# Altium project YOUTUBE_COUNTER_V01R01.PrjPCB (part 2 of 2)

## Sheet [05] - DISP DRIVERS.SchDoc: DISPLAY DRIVERS
size 433 x 279 mm; Author: ZAG; DrawnBy: ZAG; DocumentNumber: 6; SheetNumber: 5; SheetTotal: 7; PageSetup: Record=PageOptions|CenterHorizontal=True|CenterVertical=True|PrintScale=0.96|XCorrection=1.00|YCorrection=1.00|PrintKind=2|BorderSize=5000000|LeftOffset=0|BottomOffset=0|Orientation=2|PaperLength=4318|PaperWidth=2794|Scale=100|PaperSource=15|PrintQuality=600|MediaType=1|DitherType=10|PaperKind=11x17|PrintScaleMode=1; ClientCompanyName: Mule Labs, LLC; ClientContactEmail: zack@mule-labs.com; PCBRevision: 01; SchRevision: 01; Project: YOUTUBE SUBSCRIBER COUNTER; SchStatus: PRELIMINARY
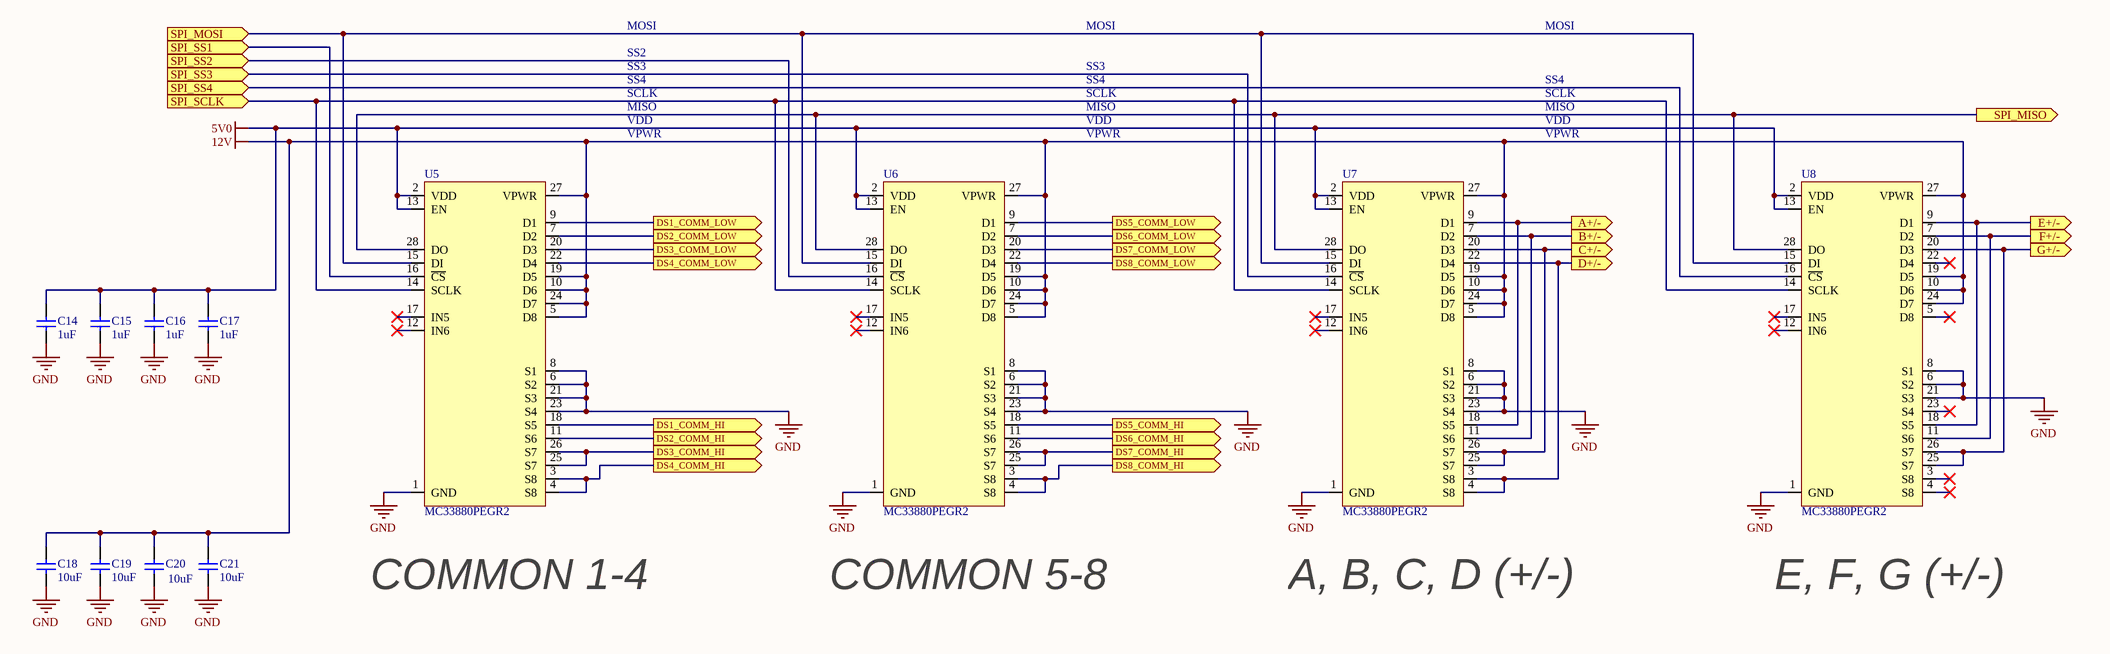
[diagram p3: [05] - DISP DRIVERS.SchDoc]

### Parts
C14  1uF  [INCH 0603 - METRIC 1608 - H090]
C15  1uF  [INCH 0603 - METRIC 1608 - H090]
C16  1uF  [INCH 0603 - METRIC 1608 - H090]
C17  1uF  [INCH 0603 - METRIC 1608 - H090]
C18  10uF  [INCH 0805 - METRIC 2012 - H140]
C19  10uF  [INCH 0805 - METRIC 2012 - H140]
C20  10uF  [INCH 0805 - METRIC 2012 - H140]
C21  10uF  [INCH 0805 - METRIC 2012 - H140]
U5  MC33880PEGR2  [SOIC28P127_1792X1030X265L65X42]
U6  MC33880PEGR2  [SOIC28P127_1792X1030X265L65X42]
U7  MC33880PEGR2  [SOIC28P127_1792X1030X265L65X42]
U8  MC33880PEGR2  [SOIC28P127_1792X1030X265L65X42]

### Ports
A+/- (out), B+/- (out), C+/- (out), D+/- (out), DS1_COMM_HI (out), DS1_COMM_LOW (out), DS2_COMM_HI (out), DS2_COMM_LOW (out), DS3_COMM_HI (out), DS3_COMM_LOW (out), DS4_COMM_HI (out), DS4_COMM_LOW (out), DS5_COMM_HI (out), DS5_COMM_LOW (out), DS6_COMM_HI (out), DS6_COMM_LOW (out), DS7_COMM_HI (out), DS7_COMM_LOW (out), DS8_COMM_HI (out), DS8_COMM_LOW (out), E+/- (out), F+/- (out), G+/- (out), SPI_MISO (out), SPI_MOSI (in), SPI_SCLK (in), SPI_SS1 (in), SPI_SS2 (in), SPI_SS3 (in), SPI_SS4 (in)

### Nets
5V0: C14.1 C15.1 C16.1 C17.1 U5.2(VDD) U5.13(EN) U6.2(VDD) U6.13(EN) U7.2(VDD) U7.13(EN) U8.2(VDD) U8.13(EN)
12V: C18.1 C19.1 C20.1 C21.1 U5.5(D8) U5.10(D6) U5.19(D5) U5.24(D7) U5.27(VPWR) U6.5(D8) U6.10(D6) U6.19(D5) U6.24(D7) U6.27(VPWR) U7.5(D8) U7.10(D6) U7.19(D5) U7.24(D7) U7.27(VPWR) U8.10(D6) U8.19(D5) U8.24(D7) U8.27(VPWR)
GND: C14.2 C15.2 C16.2 C17.2 C18.2 C19.2 C20.2 C21.2 U5.1(GND) U5.6(S2) U5.8(S1) U5.21(S3) U5.23(S4) U6.1(GND) U6.6(S2) U6.8(S1) U6.21(S3) U6.23(S4) U7.1(GND) U7.6(S2) U7.8(S1) U7.21(S3) U7.23(S4) U8.1(GND) U8.6(S2) U8.8(S1) U8.21(S3)
NetD4_1: U5.18(S5) ; port DS1_COMM_HI
NetD4_2: U5.9(D1) ; port DS1_COMM_LOW
NetD11_1: U5.11(S6) ; port DS2_COMM_HI
NetD11_2: U5.7(D2) ; port DS2_COMM_LOW
NetD18_1: U5.25(S7) U5.26(S7) ; port DS3_COMM_HI
NetD18_2: U5.20(D3) ; port DS3_COMM_LOW
NetD25_1: U5.3(S8) U5.4(S8) ; port DS4_COMM_HI
NetD25_2: U5.22(D4) ; port DS4_COMM_LOW
NetD32_1: U6.18(S5) ; port DS5_COMM_HI
NetD32_2: U6.9(D1) ; port DS5_COMM_LOW
NetD39_1: U6.11(S6) ; port DS6_COMM_HI
NetD39_2: U6.7(D2) ; port DS6_COMM_LOW
NetU3_26: U8.16(~{CS}) ; port SPI_SS4
NetU3_27: U7.16(~{CS}) ; port SPI_SS3
NetU3_28: U6.16(~{CS}) ; port SPI_SS2
NetU3_29: U5.16(~{CS}) ; port SPI_SS1
NetU3_30: U5.14(SCLK) U6.14(SCLK) U7.14(SCLK) U8.14(SCLK) ; port SPI_SCLK
NetU3_31: U5.28(DO) U6.28(DO) U7.28(DO) U8.28(DO) ; port SPI_MISO
NetU3_32: U5.15(DI) U6.15(DI) U7.15(DI) U8.15(DI) ; port SPI_MOSI
NetU6_3: U6.3(S8) U6.4(S8) ; port DS8_COMM_HI
NetU6_20: U6.20(D3) ; port DS7_COMM_LOW
NetU6_22: U6.22(D4) ; port DS8_COMM_LOW
NetU6_25: U6.25(S7) U6.26(S7) ; port DS7_COMM_HI
NetU7_3: U7.3(S8) U7.4(S8) U7.22(D4) ; port D+/-
NetU7_7: U7.7(D2) U7.11(S6) ; port B+/-
NetU7_9: U7.9(D1) U7.18(S5) ; port A+/-
NetU7_20: U7.20(D3) U7.25(S7) U7.26(S7) ; port C+/-
NetU8_7: U8.7(D2) U8.11(S6) ; port F+/-
NetU8_9: U8.9(D1) U8.18(S5) ; port E+/-
NetU8_20: U8.20(D3) U8.25(S7) U8.26(S7) ; port G+/-

Not connected (* = marked no-connect by the designer): U5 12(IN6)* 17(IN5)*; U6 12(IN6)* 17(IN5)*; U7 12(IN6)* 17(IN5)*; U8 3(S8)* 4(S8)* 5(D8)* 12(IN6)* 17(IN5)* 22(D4)* 23(S4)*

### Notes on the sheet
- MOSI
- SS2
- SCLK
- MISO
- SS3
- SS4
- VDD
- VPWR
- COMMON 1-4
- COMMON 5-8
- A, B, C, D (+/-)
- E, F, G (+/-)
- SHEET TITLE
- SCH REV:
- PROJECT NAME
- PCB REV:
- DATE:
- DRAWN BY
- CONTACT
- MANUFACTURER, OR SALE OF PROCESSES OR PRODUCTS WITHOUT THE EXPRESSED WRITTEN CONSENT OF
- THE INFORMATION CONTAINED HEREIN IS DEEMED TO BE CONFIDENTIAL, PROPRIETARY, AND A TRADE SECRET OF
- THIS INFORMATION MAY NOT BE USED, REPRODUCED, OR DISCLOSED AS THE DIRECT OR INDIRECT BASIS FOR THE DEVELOPMENT,
- SHEET
- MULE LABS, LLC
- www.mule-labs.com <http://www.mule-labs.com>
- OF
- SIZE: B
- DO NOT SCALE DRAWING

### Library data of the parts
C14-C17 = CL10B105KO8NNNC: CAP CER 1UF 16V X7R 0603; Manufacturer: Samsung; Material: Ceramic; Tolerance: 10%; Supplier 1: Digi-Key; Manufacturer Part Number: CL10B105KO8NNNC; Stock 1: 1367836; Pricing 1: 1=0.1, 10=0.046, 100=0.0207, 500=0.01478, 1000=0.01161 (USD); Mount: Surface Mount; Case/Package: 0603; Case Code (Metric): 1608; Case Code (Imperial): 0603; Min Operating Temperature: -55°C; Max Operating Temperature: 125°C; Packaging: Tape and Reel; Capacitance: 1uF; Voltage Rating: 16V; Dielectric: X7R; Voltage: 16V; Voltage Rating (DC): 16V; Length: 1.6mm; Height: 0.8mm; Width: 0.031inch; Thickness: 0.035inch; Depth: 0.8mm; Radiation Hardening: No; Lead Free: Lead Free; ComponentLink1URL: https://datasheet.ciiva.com/15195/getdatasheetpartid-357418-15195728.pdf; ComponentLink1Description: https://datasheet.ciiva.com/15195/getdatasheetpartid-357418-15195728.pdf; ComponentLink2URL: https://datasheet.ciiva.com/29198/458176-da-01-en-vs-kondensator-0603-29198478.pdf; ComponentLink2Description: https://datasheet.ciiva.com/29198/458176-da-01-en-vs-kondensator-0603-29198478.pdf; Supplier Part Number 1: 1276-1019-6-ND; Category: Capacitor
C18-C21 = GRM21BR61E106MA73L: CAP CER 10UF 25V X5R 0805; Manufacturer: Murata; Tolerance: 20%; Supplier 1: Digi-Key; Manufacturer Part Number: GRM21BR61E106MA73L; Stock 1: 30000; Pricing 1: 1=0.27, 10=0.184, 100=0.1044, 500=0.0737, 1000=0.06449 (USD); Mount: Surface Mount; Case/Package: 0805; Weight: 0.000335oz; Case Code (Metric): 2012; Case Code (Imperial): 0805; Min Operating Temperature: -55°C; Max Operating Temperature: 85°C; Capacitance: 10uF; Packaging: Tape and Reel; Dielectric: X5R; Voltage Rating: 25V; Termination: SMD/SMT; Composition: Ceramic; Voltage Rating (DC): 25V; Package Quantity: 3000; Length: 2mm; Height: 1.25mm; Width: 0.049inch; Thickness: 0.055inch; Depth: 1.25mm; REACH SVHC: No SVHC; Lead Free: Lead Free; Supplier Part Number 1: 490-10748-1-ND
U5-U8 = MC33880PEGR2: IC SRL SWITCH OCT W/SPI 28SOIC; Manufacturer: NXP Semiconductors; Max Power Dissipation: 1.3W; Number of Outputs: 8; Output Current: 800mA; Nominal Supply Current: 8mA; Interface: SPI; Fault Protection: Over Voltage; Supplier 1: Digikey; Manufacturer Part Number: MC33880PEGR2; Stock 1: 966; Pricing 1: 1 = 5.68000, 10 = 5.10000, 100 = 4.17890, 500 = 3.55742 (USD); Mount: Surface Mount; Case/Package: SOIC; Number of Pins: 28; Weight: 0.026676oz; Min Operating Temperature: -40°C; Max Operating Temperature: 125°C; Packaging: Tape and Reel; Package Quantity: 1000; Max Output Current: 800mA; Power Dissipation: 1.3W; Radiation Hardening: No; Halogen Free: Halogen Free; ComponentLink1URL: https://datasheet.ciiva.com/6607/mc33880-6607564.pdf?src-supplier=Digi-Key; ComponentLink1Description: https://datasheet.ciiva.com/6607/mc33880-6607564.pdf?src-supplier=Digi-Key; ComponentLink2URL: http://datasheet.octopart.com/MC33880PEGR2-Freescale-Semiconductor-datasheet-12526227.pdf?src-supplier=Freescale+Semiconductor; ComponentLink2Description: http://datasheet.octopart.com/MC33880PEGR2-Freescale-Semiconductor-datasheet-12526227.pdf?src-supplier=Freescale+Semiconductor; ComponentLink3URL: http://sigma.octopart.com/44489297/technical_drawing/Freescale-Semiconductor-MC33880PEGR2.pdf?src-supplier=Freescale+Semiconductor; ComponentLink3Description: http://sigma.octopart.com/44489297/technical_drawing/Freescale-Semiconductor-MC33880PEGR2.pdf?src-supplier=Freescale+Semiconductor; Supplier Part Number 1: 568-15169-1-ND

## Sheet [04] - 7 SEGMENT DISPS.SchDoc: 7 SEGMENT DISPLAYS
size 433 x 279 mm; Author: ZAG; DrawnBy: ZAG; DocumentNumber: 5; SheetNumber: 4; SheetTotal: 7; PageSetup: Record=PageOptions|CenterHorizontal=True|CenterVertical=True|PrintScale=0.96|XCorrection=1.00|YCorrection=1.00|PrintKind=2|BorderSize=5000000|LeftOffset=0|BottomOffset=0|Orientation=2|PaperLength=4318|PaperWidth=2794|Scale=100|PaperSource=15|PrintQuality=600|MediaType=1|DitherType=10|PaperKind=11x17|PrintScaleMode=1; ClientCompanyName: Mule Labs, LLC; ClientContactEmail: zack@mule-labs.com; PCBRevision: 01; SchRevision: 01; Project: YOUTUBE SUBSCRIBER COUNTER; SchStatus: PRELIMINARY
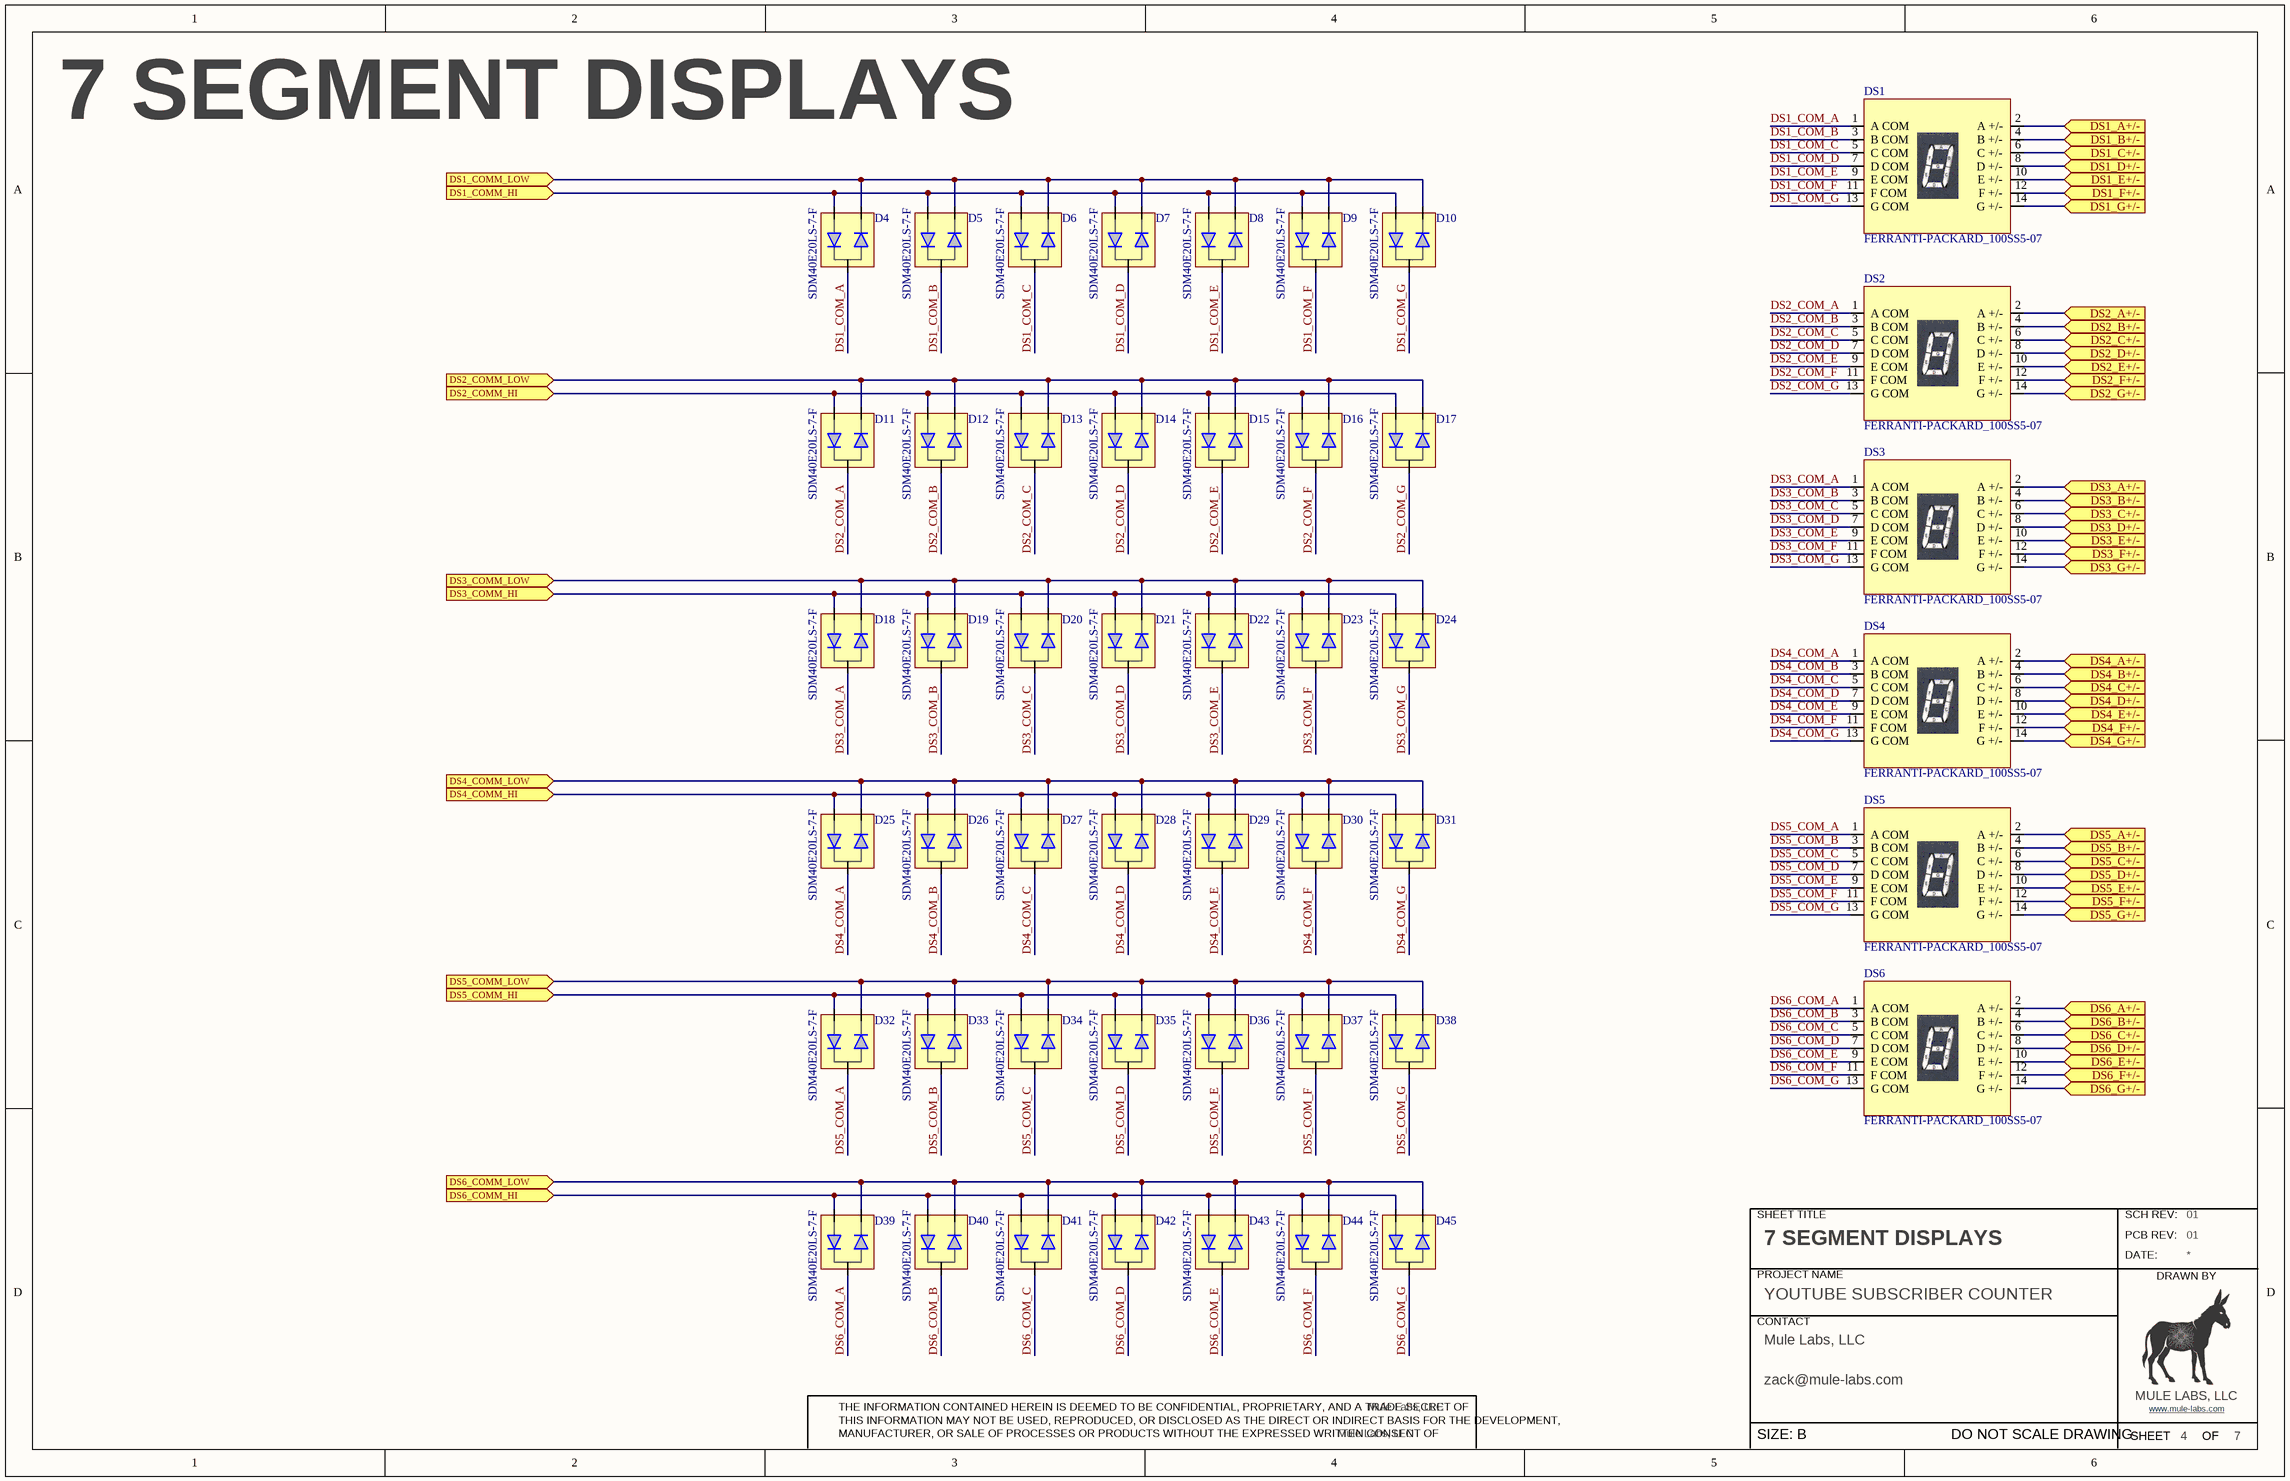
[diagram p4: [04] - 7 SEGMENT DISPS.SchDoc]

### Parts
D4  SDM40E20LS-7-F  [SOT23-3P95_240X110L40X44]
D5  SDM40E20LS-7-F  [SOT23-3P95_240X110L40X44]
D6  SDM40E20LS-7-F  [SOT23-3P95_240X110L40X44]
D7  SDM40E20LS-7-F  [SOT23-3P95_240X110L40X44]
D8  SDM40E20LS-7-F  [SOT23-3P95_240X110L40X44]
D9  SDM40E20LS-7-F  [SOT23-3P95_240X110L40X44]
D10  SDM40E20LS-7-F  [SOT23-3P95_240X110L40X44]
D11  SDM40E20LS-7-F  [SOT23-3P95_240X110L40X44]
D12  SDM40E20LS-7-F  [SOT23-3P95_240X110L40X44]
D13  SDM40E20LS-7-F  [SOT23-3P95_240X110L40X44]
D14  SDM40E20LS-7-F  [SOT23-3P95_240X110L40X44]
D15  SDM40E20LS-7-F  [SOT23-3P95_240X110L40X44]
D16  SDM40E20LS-7-F  [SOT23-3P95_240X110L40X44]
D17  SDM40E20LS-7-F  [SOT23-3P95_240X110L40X44]
D18  SDM40E20LS-7-F  [SOT23-3P95_240X110L40X44]
D19  SDM40E20LS-7-F  [SOT23-3P95_240X110L40X44]
D20  SDM40E20LS-7-F  [SOT23-3P95_240X110L40X44]
D21  SDM40E20LS-7-F  [SOT23-3P95_240X110L40X44]
D22  SDM40E20LS-7-F  [SOT23-3P95_240X110L40X44]
D23  SDM40E20LS-7-F  [SOT23-3P95_240X110L40X44]
D24  SDM40E20LS-7-F  [SOT23-3P95_240X110L40X44]
D25  SDM40E20LS-7-F  [SOT23-3P95_240X110L40X44]
D26  SDM40E20LS-7-F  [SOT23-3P95_240X110L40X44]
D27  SDM40E20LS-7-F  [SOT23-3P95_240X110L40X44]
D28  SDM40E20LS-7-F  [SOT23-3P95_240X110L40X44]
D29  SDM40E20LS-7-F  [SOT23-3P95_240X110L40X44]
D30  SDM40E20LS-7-F  [SOT23-3P95_240X110L40X44]
D31  SDM40E20LS-7-F  [SOT23-3P95_240X110L40X44]
D32  SDM40E20LS-7-F  [SOT23-3P95_240X110L40X44]
D33  SDM40E20LS-7-F  [SOT23-3P95_240X110L40X44]
D34  SDM40E20LS-7-F  [SOT23-3P95_240X110L40X44]
D35  SDM40E20LS-7-F  [SOT23-3P95_240X110L40X44]
D36  SDM40E20LS-7-F  [SOT23-3P95_240X110L40X44]
D37  SDM40E20LS-7-F  [SOT23-3P95_240X110L40X44]
D38  SDM40E20LS-7-F  [SOT23-3P95_240X110L40X44]
D39  SDM40E20LS-7-F  [SOT23-3P95_240X110L40X44]
D40  SDM40E20LS-7-F  [SOT23-3P95_240X110L40X44]
D41  SDM40E20LS-7-F  [SOT23-3P95_240X110L40X44]
D42  SDM40E20LS-7-F  [SOT23-3P95_240X110L40X44]
D43  SDM40E20LS-7-F  [SOT23-3P95_240X110L40X44]
D44  SDM40E20LS-7-F  [SOT23-3P95_240X110L40X44]
D45  SDM40E20LS-7-F  [SOT23-3P95_240X110L40X44]
DS1  FERRANTI-PACKARD_100SS5-07  [FERRANTI_EM_7SEG]
DS2  FERRANTI-PACKARD_100SS5-07  [FERRANTI_EM_7SEG]
DS3  FERRANTI-PACKARD_100SS5-07  [FERRANTI_EM_7SEG]
DS4  FERRANTI-PACKARD_100SS5-07  [FERRANTI_EM_7SEG]
DS5  FERRANTI-PACKARD_100SS5-07  [FERRANTI_EM_7SEG]
DS6  FERRANTI-PACKARD_100SS5-07  [FERRANTI_EM_7SEG]

### Ports
DS1_A+/- (in), DS1_B+/- (in), DS1_C+/- (in), DS1_COMM_HI (in), DS1_COMM_LOW (in), DS1_D+/- (in), DS1_E+/- (in), DS1_F+/- (in), DS1_G+/- (in), DS2_A+/- (in), DS2_B+/- (in), DS2_C+/- (in), DS2_COMM_HI (in), DS2_COMM_LOW (in), DS2_D+/- (in), DS2_E+/- (in), DS2_F+/- (in), DS2_G+/- (in), DS3_A+/- (in), DS3_B+/- (in), DS3_C+/- (in), DS3_COMM_HI (in), DS3_COMM_LOW (in), DS3_D+/- (in), DS3_E+/- (in), DS3_F+/- (in), DS3_G+/- (in), DS4_A+/- (in), DS4_B+/- (in), DS4_C+/- (in), DS4_COMM_HI (in), DS4_COMM_LOW (in), DS4_D+/- (in), DS4_E+/- (in), DS4_F+/- (in), DS4_G+/- (in), DS5_A+/- (in), DS5_B+/- (in), DS5_C+/- (in), DS5_COMM_HI (in), DS5_COMM_LOW (in), DS5_D+/- (in), DS5_E+/- (in), DS5_F+/- (in), DS5_G+/- (in), DS6_A+/- (in), DS6_B+/- (in), DS6_C+/- (in), DS6_COMM_HI (in), DS6_COMM_LOW (in), DS6_D+/- (in), DS6_E+/- (in), DS6_F+/- (in), DS6_G+/- (in)

### Nets
DS1_COM_A: D4.3 DS1.1(A_COM)
DS1_COM_B: D5.3 DS1.3(B_COM)
DS1_COM_C: D6.3 DS1.5(C_COM)
DS1_COM_D: D7.3 DS1.7(D_COM)
DS1_COM_E: D8.3 DS1.9(E_COM)
DS1_COM_F: D9.3 DS1.11(F_COM)
DS1_COM_G: D10.3 DS1.13(G_COM)
DS2_COM_A: D11.3 DS2.1(A_COM)
DS2_COM_B: D12.3 DS2.3(B_COM)
DS2_COM_C: D13.3 DS2.5(C_COM)
DS2_COM_D: D14.3 DS2.7(D_COM)
DS2_COM_E: D15.3 DS2.9(E_COM)
DS2_COM_F: D16.3 DS2.11(F_COM)
DS2_COM_G: D17.3 DS2.13(G_COM)
DS3_COM_A: D18.3 DS3.1(A_COM)
DS3_COM_B: D19.3 DS3.3(B_COM)
DS3_COM_C: D20.3 DS3.5(C_COM)
DS3_COM_D: D21.3 DS3.7(D_COM)
DS3_COM_E: D22.3 DS3.9(E_COM)
DS3_COM_F: D23.3 DS3.11(F_COM)
DS3_COM_G: D24.3 DS3.13(G_COM)
DS4_COM_A: D25.3 DS4.1(A_COM)
DS4_COM_B: D26.3 DS4.3(B_COM)
DS4_COM_C: D27.3 DS4.5(C_COM)
DS4_COM_D: D28.3 DS4.7(D_COM)
DS4_COM_E: D29.3 DS4.9(E_COM)
DS4_COM_F: D30.3 DS4.11(F_COM)
DS4_COM_G: D31.3 DS4.13(G_COM)
DS5_COM_A: D32.3 DS5.1(A_COM)
DS5_COM_B: D33.3 DS5.3(B_COM)
DS5_COM_C: D34.3 DS5.5(C_COM)
DS5_COM_D: D35.3 DS5.7(D_COM)
DS5_COM_E: D36.3 DS5.9(E_COM)
DS5_COM_F: D37.3 DS5.11(F_COM)
DS5_COM_G: D38.3 DS5.13(G_COM)
DS6_COM_A: D39.3 DS6.1(A_COM)
DS6_COM_B: D40.3 DS6.3(B_COM)
DS6_COM_C: D41.3 DS6.5(C_COM)
DS6_COM_D: D42.3 DS6.7(D_COM)
DS6_COM_E: D43.3 DS6.9(E_COM)
DS6_COM_F: D44.3 DS6.11(F_COM)
DS6_COM_G: D45.3 DS6.13(G_COM)
NetD4_1: D4.1 D5.1 D6.1 D7.1 D8.1 D9.1 D10.1 ; port DS1_COMM_HI
NetD4_2: D4.2 D5.2 D6.2 D7.2 D8.2 D9.2 D10.2 ; port DS1_COMM_LOW
NetD11_1: D11.1 D12.1 D13.1 D14.1 D15.1 D16.1 D17.1 ; port DS2_COMM_HI
NetD11_2: D11.2 D12.2 D13.2 D14.2 D15.2 D16.2 D17.2 ; port DS2_COMM_LOW
NetD18_1: D18.1 D19.1 D20.1 D21.1 D22.1 D23.1 D24.1 ; port DS3_COMM_HI
NetD18_2: D18.2 D19.2 D20.2 D21.2 D22.2 D23.2 D24.2 ; port DS3_COMM_LOW
NetD25_1: D25.1 D26.1 D27.1 D28.1 D29.1 D30.1 D31.1 ; port DS4_COMM_HI
NetD25_2: D25.2 D26.2 D27.2 D28.2 D29.2 D30.2 D31.2 ; port DS4_COMM_LOW
NetD32_1: D32.1 D33.1 D34.1 D35.1 D36.1 D37.1 D38.1 ; port DS5_COMM_HI
NetD32_2: D32.2 D33.2 D34.2 D35.2 D36.2 D37.2 D38.2 ; port DS5_COMM_LOW
NetD39_1: D39.1 D40.1 D41.1 D42.1 D43.1 D44.1 D45.1 ; port DS6_COMM_HI
NetD39_2: D39.2 D40.2 D41.2 D42.2 D43.2 D44.2 D45.2 ; port DS6_COMM_LOW
NetDS1_2: DS1.2(A_+/-) ; port DS1_A+/-
NetDS1_4: DS1.4(B_+/-) ; port DS1_B+/-
NetDS1_6: DS1.6(C_+/-) ; port DS1_C+/-
NetDS1_8: DS1.8(D_+/-) ; port DS1_D+/-
NetDS1_10: DS1.10(E_+/-) ; port DS1_E+/-
NetDS1_12: DS1.12(F_+/-) ; port DS1_F+/-
NetDS1_14: DS1.14(G_+/-) ; port DS1_G+/-
NetDS2_2: DS2.2(A_+/-) ; port DS2_A+/-
NetDS2_4: DS2.4(B_+/-) ; port DS2_B+/-
NetDS2_6: DS2.6(C_+/-) ; port DS2_C+/-
NetDS2_8: DS2.8(D_+/-) ; port DS2_D+/-
NetDS2_10: DS2.10(E_+/-) ; port DS2_E+/-
NetDS2_12: DS2.12(F_+/-) ; port DS2_F+/-
NetDS2_14: DS2.14(G_+/-) ; port DS2_G+/-
NetDS3_2: DS3.2(A_+/-) ; port DS3_A+/-
NetDS3_4: DS3.4(B_+/-) ; port DS3_B+/-
NetDS3_6: DS3.6(C_+/-) ; port DS3_C+/-
NetDS3_8: DS3.8(D_+/-) ; port DS3_D+/-
NetDS3_10: DS3.10(E_+/-) ; port DS3_E+/-
NetDS3_12: DS3.12(F_+/-) ; port DS3_F+/-
NetDS3_14: DS3.14(G_+/-) ; port DS3_G+/-
NetDS4_2: DS4.2(A_+/-) ; port DS4_A+/-
NetDS4_4: DS4.4(B_+/-) ; port DS4_B+/-
NetDS4_6: DS4.6(C_+/-) ; port DS4_C+/-
NetDS4_8: DS4.8(D_+/-) ; port DS4_D+/-
NetDS4_10: DS4.10(E_+/-) ; port DS4_E+/-
NetDS4_12: DS4.12(F_+/-) ; port DS4_F+/-
NetDS4_14: DS4.14(G_+/-) ; port DS4_G+/-
NetDS5_2: DS5.2(A_+/-) ; port DS5_A+/-
NetDS5_4: DS5.4(B_+/-) ; port DS5_B+/-
NetDS5_6: DS5.6(C_+/-) ; port DS5_C+/-
NetDS5_8: DS5.8(D_+/-) ; port DS5_D+/-
NetDS5_10: DS5.10(E_+/-) ; port DS5_E+/-
NetDS5_12: DS5.12(F_+/-) ; port DS5_F+/-
NetDS5_14: DS5.14(G_+/-) ; port DS5_G+/-
NetDS6_2: DS6.2(A_+/-) ; port DS6_A+/-
NetDS6_4: DS6.4(B_+/-) ; port DS6_B+/-
NetDS6_6: DS6.6(C_+/-) ; port DS6_C+/-
NetDS6_8: DS6.8(D_+/-) ; port DS6_D+/-
NetDS6_10: DS6.10(E_+/-) ; port DS6_E+/-
NetDS6_12: DS6.12(F_+/-) ; port DS6_F+/-
NetDS6_14: DS6.14(G_+/-) ; port DS6_G+/-

### Notes on the sheet
- SHEET TITLE
- SCH REV:
- PROJECT NAME
- PCB REV:
- DATE:
- DRAWN BY
- CONTACT
- MANUFACTURER, OR SALE OF PROCESSES OR PRODUCTS WITHOUT THE EXPRESSED WRITTEN CONSENT OF
- THE INFORMATION CONTAINED HEREIN IS DEEMED TO BE CONFIDENTIAL, PROPRIETARY, AND A TRADE SECRET OF
- THIS INFORMATION MAY NOT BE USED, REPRODUCED, OR DISCLOSED AS THE DIRECT OR INDIRECT BASIS FOR THE DEVELOPMENT,
- SHEET
- MULE LABS, LLC
- www.mule-labs.com <http://www.mule-labs.com>
- OF
- SIZE: B
- DO NOT SCALE DRAWING

### Library data of the parts
D4-D45 = SDM40E20LS-7-F: DIODE ARRAY SCHOTTKY 20V SOT23-3; Manufacturer: Diodes; Max Power Dissipation: 300mW; Forward Current: 400mA; Peak Reverse Current: 250uA; Forward Voltage: 430mV; Max Forward Surge Current (Ifsm): 2A; Capacitance: 170pF; Supplier 1: Digi-Key; Manufacturer Part Number: SDM40E20LS-7-F; RoHS: Yes; Stock 1: 64457; Pricing 1: 1 = 0.45000, 10 = 0.38200, 100 = 0.28550, 500 = 0.22434, 1000 = 0.17335 (USD); Mount: Surface Mount; Case/Package: SOT-23; Number of Pins: 3; Weight: 0.000282oz; Min Operating Temperature: -65°C; Max Operating Temperature: 125°C; Package Quantity: 3000; Packaging: Tape and Reel; Average Rectified Current: 400mA; Max Repetitive Reverse Voltage (Vrrm): 20V; Peak Non-Repetitive Surge Current: 2A; Power Dissipation: 300mW; Termination: SMD/SMT; Current Rating: 400mA; Power Rating: 300mW; Voltage Rating (DC): 20V; Max Reverse Voltage (DC): 20V; Length: 3mm; Height: 1.1mm; Width: 1.4mm; Radiation Hardening: No; REACH SVHC: No SVHC; Lead Free: Lead Free; ComponentLink1URL: https://datasheet.ciiva.com/905/ds30298-905328.pdf?src-supplier=Digi-Key; ComponentLink1Description: https://datasheet.ciiva.com/905/ds30298-905328.pdf?src-supplier=Digi-Key; ComponentLink2URL: https://datasheet.ciiva.com/4715/ds30298-90424-4715745.pdf?src-supplier=Mouser; ComponentLink2Description: https://datasheet.ciiva.com/4715/ds30298-90424-4715745.pdf?src-supplier=Mouser; ComponentLink3URL: https://datasheet.ciiva.com/8301/ds30298-8301189.pdf?src-supplier=Avnet; ComponentLink3Description: https://datasheet.ciiva.com/8301/ds30298-8301189.pdf?src-supplier=Avnet; ComponentLink4URL: https://datasheet.ciiva.com/8301/ds30298-8301192.pdf?src-supplier=Avnet; ComponentLink4Description: https://datasheet.ciiva.com/8301/ds30298-8301192.pdf?src-supplier=Avnet; ComponentLink5URL: https://datasheet.ciiva.com/25945/ds30298-25945688.pdf?src-supplier=Avnet+Europe; ComponentLink5Description: https://datasheet.ciiva.com/25945/ds30298-25945688.pdf?src-supplier=Avnet+Europe; ComponentLink6URL: https://datasheet.ciiva.com/16200/ds30298-16200250.pdf?src-supplier=Future+Electronics; ComponentLink6Description: https://datasheet.ciiva.com/16200/ds30298-16200250.pdf?src-supplier=Future+Electronics; ComponentLink7URL: https://datasheet.ciiva.com/22695/639200-22695851.pdf?src-supplier=Element14; ComponentLink7Description: https://datasheet.ciiva.com/22695/639200-22695851.pdf?src-supplier=Element14; ComponentLink8URL: https://datasheet.ciiva.com/905/ds30298-905326.pdf?src-supplier=Digi-Key; ComponentLink8Description: https://datasheet.ciiva.com/905/ds30298-905326.pdf?src-supplier=Digi-Key; ComponentLink9URL: https://datasheet.ciiva.com/7964/ds30298-7964334.pdf?src-supplier=Element14; ComponentLink9Description: https://datasheet.ciiva.com/7964/ds30298-7964334.pdf?src-supplier=Element14; ComponentLink10URL: https://datasheet.ciiva.com/905/ds30298-905327.pdf?src-supplier=Digi-Key; ComponentLink10Description: https://datasheet.ciiva.com/905/ds30298-905327.pdf?src-supplier=Digi-Key; Supplier Part Number 1: SDM40E20LS-FDICT-ND
DS1-DS6 = FERRANTI_PACKARD_7SEG: ELECTROMECHANICAL 7-SEGMENT DISPLAY

## Sheet [06] - HELPFUL INFO.SchDoc: HELPFUL INFO
size 433 x 279 mm; Author: ZAG; DrawnBy: ZAG; DocumentNumber: 8; SheetNumber: 6; SheetTotal: 7; PageSetup: Record=PageOptions|CenterHorizontal=True|CenterVertical=True|PrintScale=0.96|XCorrection=1.00|YCorrection=1.00|PrintKind=2|BorderSize=5000000|LeftOffset=0|BottomOffset=0|Orientation=2|PaperLength=4318|PaperWidth=2794|Scale=100|PaperSource=15|PrintQuality=600|MediaType=1|DitherType=10|PaperKind=11x17|PrintScaleMode=1; ClientCompanyName: Mule Labs, LLC; ClientContactEmail: zack@mule-labs.com; PCBRevision: 01; SchRevision: 01; Project: YOUTUBE SUBSCRIBER COUNTER; SchStatus: PRELIMINARY
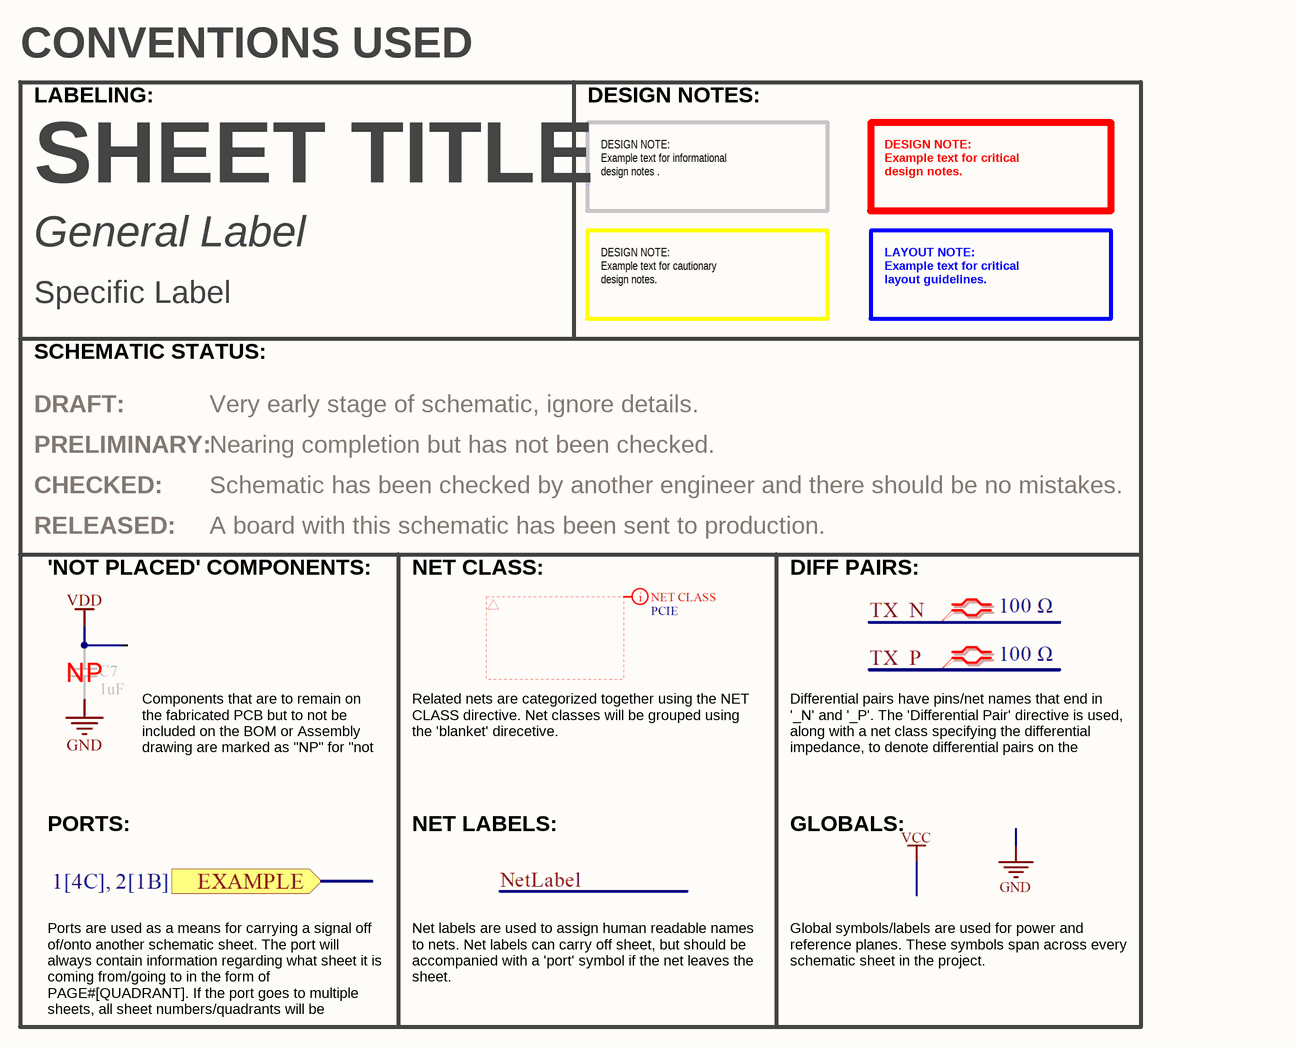
[diagram p5: [06] - HELPFUL INFO.SchDoc]

### Notes on the sheet
- CONVENTIONS USED
- LABELING:
- DESIGN NOTES:
- SHEET TITLE
- DESIGN NOTE:
  Example text for informational
  design notes .
- DESIGN NOTE:
  Example text for critical
  design notes.
- General Label
- Specific Label
- DESIGN NOTE:
  Example text for cautionary
  design notes.
- LAYOUT NOTE:
  Example text for critical
  layout guidelines.
- SCHEMATIC STATUS:
- PRELIMINARY:
- DRAFT:
- Very early stage of schematic, ignore details.
- Nearing completion but has not been checked.
- RELEASED:
- CHECKED:
- Schematic has been checked by another engineer and there should be no mistakes.
- A board with this schematic has been sent to production.
- 'NOT PLACED' COMPONENTS:
- NET CLASS:
- DIFF PAIRS:
- Related nets are categorized together using the NET CLASS directive. Net classes will be grouped using the 'blanket' direcetive.
- Components that are to remain on the fabricated PCB but to not be included on the BOM or Assembly drawing are marked as "NP" for "not placed".
- Differential pairs have pins/net names that end in '_N' and '_P'. The 'Differential Pair' directive is used, along with a net class specifying the differential impedance, to denote differential pairs on the schematic.
- PORTS:
- NET LABELS:
- GLOBALS:
- Ports are used as a means for carrying a signal off of/onto another schematic sheet. The port will always contain information regarding what sheet it is coming from/going to in the form of PAGE#[QUADRANT]. If the port goes to multiple sheets, all sheet numbers/quadrants will be displayed next to the port.
- Net labels are used to assign human readable names to nets. Net labels can carry off sheet, but should be accompanied with a 'port' symbol if the net leaves the sheet.
- Global symbols/labels are used for power and reference planes. These symbols span across every schematic sheet in the project.
- SCH REV:
- PROJECT NAME
- PCB REV:
- DATE:
- DRAWN BY
- CONTACT
- MANUFACTURER, OR SALE OF PROCESSES OR PRODUCTS WITHOUT THE EXPRESSED WRITTEN CONSENT OF
- THE INFORMATION CONTAINED HEREIN IS DEEMED TO BE CONFIDENTIAL, PROPRIETARY, AND A TRADE SECRET OF
- THIS INFORMATION MAY NOT BE USED, REPRODUCED, OR DISCLOSED AS THE DIRECT OR INDIRECT BASIS FOR THE DEVELOPMENT,
- SHEET
- MULE LABS, LLC
- www.mule-labs.com <http://www.mule-labs.com>
- OF
- SIZE: B
- DO NOT SCALE DRAWING

## Sheet [07] - REVISION HISTORY.SchDoc: REVISION HISTORY
size 433 x 279 mm; Author: ZAG; DrawnBy: ZAG; DocumentNumber: 9; SheetNumber: 7; SheetTotal: 7; PageSetup: Record=PageOptions|CenterHorizontal=True|CenterVertical=True|PrintScale=0.96|XCorrection=1.00|YCorrection=1.00|PrintKind=2|BorderSize=5000000|LeftOffset=0|BottomOffset=0|Orientation=2|PaperLength=4318|PaperWidth=2794|Scale=100|PaperSource=15|PrintQuality=600|MediaType=1|DitherType=10|PaperKind=11x17|PrintScaleMode=1; SchRevision: 01; PCBRevision: 01; Project: YOUTUBE SUBSCRIBER COUNTER; SchStatus: PRELIMINARY; ClientCompanyName: Mule Labs, LLC; ClientContactEmail: zack@mule-labs.com
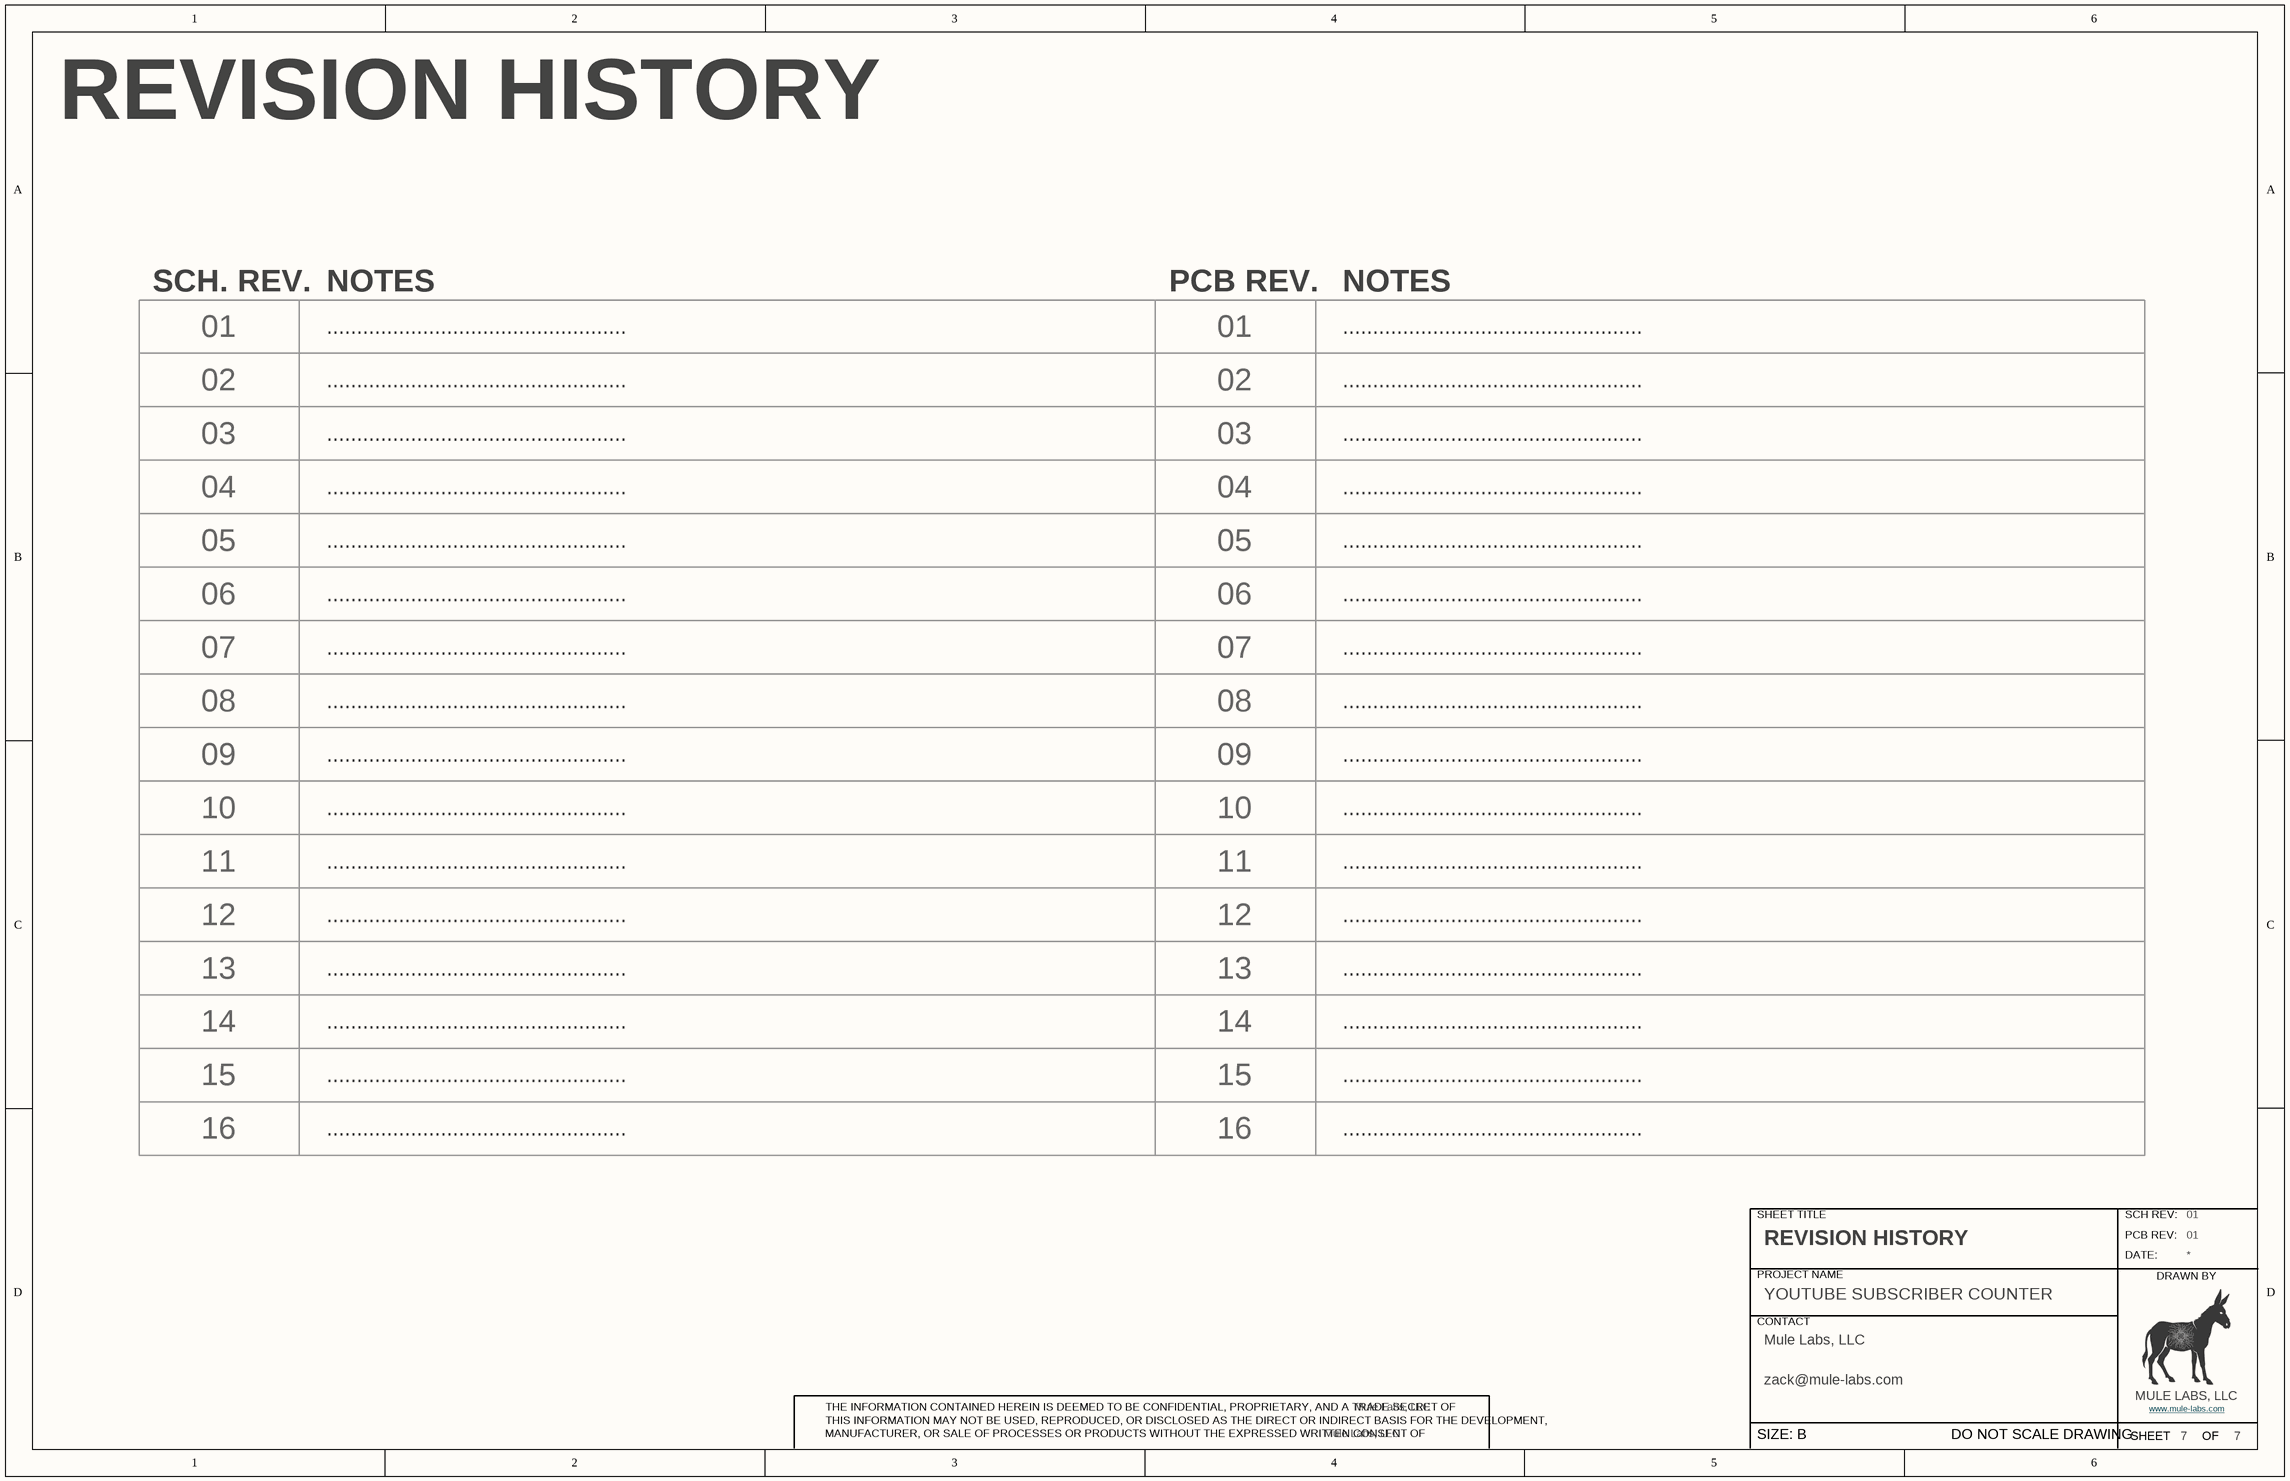
[diagram p6: [07] - REVISION HISTORY.SchDoc]

### Notes on the sheet
- SCH. REV.
- NOTES
- PCB REV.
- 01
- ..................................................
- 02
- 03
- 04
- 05
- 06
- 07
- 08
- 09
- 10
- 11
- 12
- 13
- 14
- 15
- 16
- SHEET TITLE
- SCH REV:
- PROJECT NAME
- PCB REV:
- DATE:
- DRAWN BY
- CONTACT
- MANUFACTURER, OR SALE OF PROCESSES OR PRODUCTS WITHOUT THE EXPRESSED WRITTEN CONSENT OF
- THE INFORMATION CONTAINED HEREIN IS DEEMED TO BE CONFIDENTIAL, PROPRIETARY, AND A TRADE SECRET OF
- THIS INFORMATION MAY NOT BE USED, REPRODUCED, OR DISCLOSED AS THE DIRECT OR INDIRECT BASIS FOR THE DEVELOPMENT,
- SHEET
- MULE LABS, LLC
- www.mule-labs.com <http://www.mule-labs.com>
- OF
- SIZE: B
- DO NOT SCALE DRAWING

## Nets that join several sheets
3V3: [02] - BLOCK DIAGRAM (C2.1 U1.2), [03] - ESP32 (11 pins)
5V0: [02] - BLOCK DIAGRAM (C4.1 R1.1 U2.2), [03] - ESP32 (C10.1 C11.2 U4.8), [05] - DISP DRIVERS (12 pins)
12V: [02] - BLOCK DIAGRAM (5 pins), [05] - DISP DRIVERS (23 pins)
GND: [02] - BLOCK DIAGRAM (11 pins), [03] - ESP32 (20 pins), [05] - DISP DRIVERS (27 pins)
NetD4_1: [05] - DISP DRIVERS (U5.18), [04] - 7 SEGMENT DISPS (7 pins)
NetD4_2: [05] - DISP DRIVERS (U5.9), [04] - 7 SEGMENT DISPS (7 pins)
NetD11_1: [05] - DISP DRIVERS (U5.11), [04] - 7 SEGMENT DISPS (7 pins)
NetD11_2: [05] - DISP DRIVERS (U5.7), [04] - 7 SEGMENT DISPS (7 pins)
NetD18_1: [05] - DISP DRIVERS (U5.25 U5.26), [04] - 7 SEGMENT DISPS (7 pins)
NetD18_2: [05] - DISP DRIVERS (U5.20), [04] - 7 SEGMENT DISPS (7 pins)
NetD25_1: [05] - DISP DRIVERS (U5.3 U5.4), [04] - 7 SEGMENT DISPS (7 pins)
NetD25_2: [05] - DISP DRIVERS (U5.22), [04] - 7 SEGMENT DISPS (7 pins)
NetD32_1: [05] - DISP DRIVERS (U6.18), [04] - 7 SEGMENT DISPS (7 pins)
NetD32_2: [05] - DISP DRIVERS (U6.9), [04] - 7 SEGMENT DISPS (7 pins)
NetD39_1: [05] - DISP DRIVERS (U6.11), [04] - 7 SEGMENT DISPS (7 pins)
NetD39_2: [05] - DISP DRIVERS (U6.7), [04] - 7 SEGMENT DISPS (7 pins)
NetU3_26: [03] - ESP32 (U3.26), [05] - DISP DRIVERS (U8.16)
NetU3_27: [03] - ESP32 (U3.27), [05] - DISP DRIVERS (U7.16)
NetU3_28: [03] - ESP32 (U3.28), [05] - DISP DRIVERS (U6.16)
NetU3_29: [03] - ESP32 (U3.29), [05] - DISP DRIVERS (U5.16)
NetU3_30: [03] - ESP32 (U3.30), [05] - DISP DRIVERS (U5.14 U6.14 U7.14 U8.14)
NetU3_31: [03] - ESP32 (U3.31), [05] - DISP DRIVERS (U5.28 U6.28 U7.28 U8.28)
NetU3_32: [03] - ESP32 (U3.32 U3.37), [05] - DISP DRIVERS (U5.15 U6.15 U7.15 U8.15)

## Assembly variants
ORIGINAL: all parts fitted